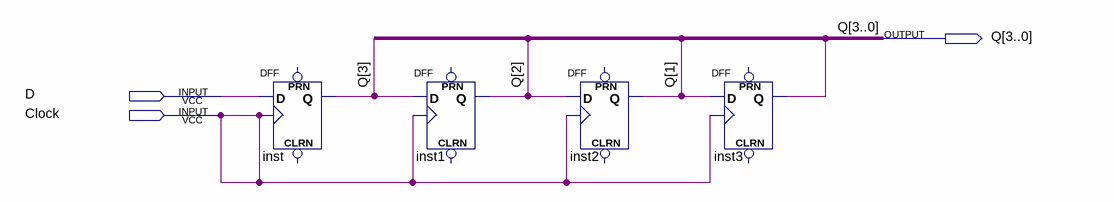
[diagram p0: schematic sheet]
// Quartus schematic THANHGHI4BIT.bdf as structural Verilog: 4 symbols, 3 pins
module THANHGHI4BIT (
  input  D,
  input  Clock,
  output [3:0] Q
);

  wire inst3_q;

  DFF inst (.CLK(Clock), .D(D), .Q(Q[3]));  // open: CLRN, PRN
  DFF inst1 (.CLK(Clock), .D(Q[3]), .Q(Q[2]));  // open: CLRN, PRN
  DFF inst2 (.CLK(Clock), .D(Q[2]), .Q(Q[1]));  // open: CLRN, PRN
  DFF inst3 (.CLK(Clock), .D(Q[1]), .Q(inst3_q));  // open: CLRN, PRN
endmodule
